# Altium schematic sheet Si7021.SchDoc: LPEDT_Project_Schematic
size A; Revision: 1; SheetNumber: 3; SheetTotal: 7
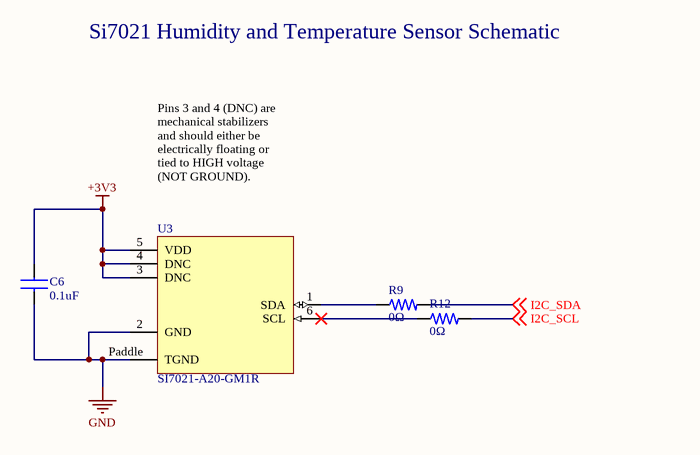
[diagram p0: Si7021.SchDoc]

## Parts
C6  0.1uF  [C_0603]
R9  0Ω  [R_0603]
R12  0Ω  [R_0603]
U3  SI7021-A20-GM1R  [U_Si7021]

## Nets
+3V3: C6.1 U3.3(DNC) U3.4(DNC) U3.5(VDD)
GND: C6.2 U3.2(GND) U3.Paddle(TGND)
I2C_SCL: R12.2 ; off-sheet I2C_SCL
I2C_SDA: R9.2 ; off-sheet I2C_SDA
NetR9_1: R9.1 U3.1(SDA)
NetR12_1: R12.1 U3.6(SCL)

## Notes on the sheet
- Si7021 Humidity and Temperature Sensor Schematic
- Pins 3 and 4 (DNC) are mechanical stabilizers and should either be electrically floating or tied to HIGH voltage (NOT GROUND).

## Library data of the parts
C6 = C_0.1U_0603: CAP CER 0.1UF 10V X5R 0603; Manufacturer: KEMET; Manufacturer Part Number: C0603C104K8PAC7867; Dielectric Material: Ceramic; Supplier: Digikey; Supplier Part Number: 399-17573-1-ND; RoHS: Yes; Category: Ceramic Capacitors; Stock: 13122; Pricing: 1=0.18, 10=0.119, 50=0.075, 100=0.06, 500=0.04332, 1000=0.03833 (USD); Pins: 2; Capacitor Type: Ceramic; Reach SVHC Compliant: Yes; RoHS Compliant: Yes; ComponentLink1URL: https://datasheet.ciiva.com:443/pdfs/VipMasterIC/IC/KEME/KEME-S-A0007617622/KEME-S-A0007611556-1.pdf?src-supplier=IHS+Markit; ComponentLink1Description: https://datasheet.ciiva.com:443/pdfs/VipMasterIC/IC/KEME/KEME-S-A0007617622/KEME-S-A0007611556-1.pdf?src-supplier=IHS+Markit; ComponentLink2URL: https://api.kemet.com/component-edge/download/datasheet/C0603C104K8PAC7867.pdf?src-supplier=Digikey; ComponentLink2Description: https://api.kemet.com/component-edge/download/datasheet/C0603C104K8PAC7867.pdf?src-supplier=Digikey
R9 R12 = R_0_0603: RES 0OHM 0.1W 0603; Manufacturer: Stackpole Electronics; Manufacturer Part Number: RMCF0603ZT0R00; Power: 100mW; Rated Temperature: 70°C; Value: 0R; Working Voltage: 75V; Package Height: 0.45mm; Package Length: 1.55mm; Package Width: 0.8mm; Reference Standard: AEC-Q200; Supplier: Digikey; Supplier Part Number: RMCF0603ZT0R00CT-ND; RoHS: Yes; Category: Chip SMD Resistors; Stock: 13173551; Pricing: 1=0.1, 10=0.013, 25=0.0096, 50=0.0072, 100=0.0051, 250=0.00408, 500=0.00328, 1000=0.00241 (USD); Mounting Technology: Surface Mount; Pins: 2; Package Shape: Rectangular; Case/Package: 0603; Terminal Finish: Nickel; Min Operating Temperature: -55°C; Max Operating Temperature: 155°C; JESD-609 Code: e3; Resistor Type: FIXED RESISTOR; Construction: Rectangular; Package Style: SMTMeter; Packaging: Tape and Reel; Technology: METAL GLAZE/THICK FILM; Termination: Wraparound; Reach SVHC Compliant: Yes; RoHS Compliant: Yes; ComponentLink1URL: https://datasheet.ciiva.com:443/pdfs/VipMasterIC/IC/SEIE/SEIE-S-A0007077258/SEIE-S-A0007077258-1.pdf?src-supplier=IHS+Markit; ComponentLink1Description: https://datasheet.ciiva.com:443/pdfs/VipMasterIC/IC/SEIE/SEIE-S-A0007077258/SEIE-S-A0007077258-1.pdf?src-supplier=IHS+Markit; ComponentLink2URL: https://datasheet.octopart.com/RMCF0603ZT0R00-Stackpole-Electronics-datasheet-11547379.pdf?src-supplier=Future+Electronics; ComponentLink2Description: https://datasheet.octopart.com/RMCF0603ZT0R00-Stackpole-Electronics-datasheet-11547379.pdf?src-supplier=Future+Electronics; ComponentLink3URL: https://www.seielect.com/catalog/SEI-Packaging.pdf?src-supplier=Avnet; ComponentLink3Description: https://www.seielect.com/catalog/SEI-Packaging.pdf?src-supplier=Avnet; ComponentLink4URL: https://www.seielect.com/catalog/SEI-Packaging.pdf?src-supplier=Arrow+Electronics; ComponentLink4Description: https://www.seielect.com/catalog/SEI-Packaging.pdf?src-supplier=Arrow+Electronics; ComponentLink5URL: https://www.seielect.com/catalog/SEI-Packaging.pdf?src-supplier=Verical; ComponentLink5Description: https://www.seielect.com/catalog/SEI-Packaging.pdf?src-supplier=Verical; ComponentLink6URL: https://datasheet.octopart.com/RMCF0603ZT0R00-Stackpole-Electronics-datasheet-154799224.pdf?src-supplier=Master+Electronics; ComponentLink6Description: https://datasheet.octopart.com/RMCF0603ZT0R00-Stackpole-Electronics-datasheet-154799224.pdf?src-supplier=Master+Electronics
U3 = U_Si7021: Humidity, Temperature 0 ~ 100% RH I2C ±3% RH 18 s Surface Mount; Supplier 1: Digikey; Supplier Part Number 1: 336-4380-1-ND